# EAGLE design untitled (EAGLE 7.3.0)
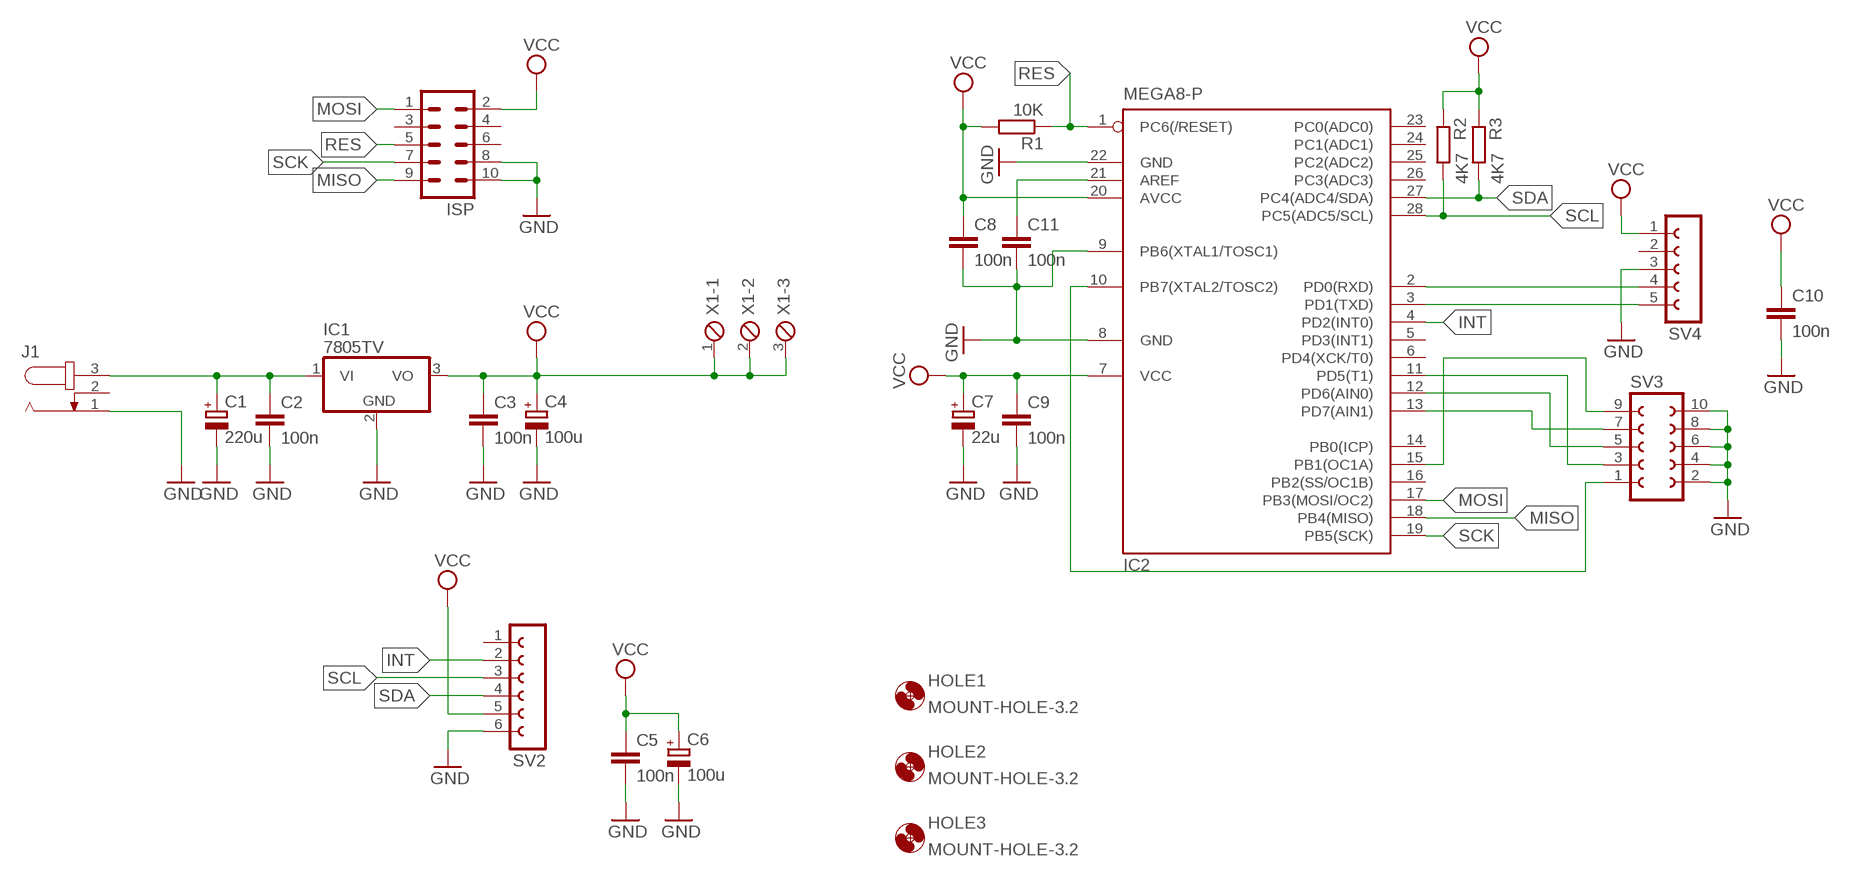
[diagram p0: schematic, sheet 1]

## Parts
C1  220u  CPOL-EUE3.5-8  [E3,5-8]
C2  100n  C-EU025-025X050  [C025-025X050]
C3  100n  C-EU025-025X050  [C025-025X050]
C4  100u  CPOL-EUE2.5-5  [E2,5-5]
C5  100n  C-EU025-025X050  [C025-025X050]
C6  100u  CPOL-EUE2.5-5  [E2,5-5]
C7  22u  CPOL-EUE2.5-5  [E2,5-5]
C8  100n  C-EU025-025X050  [C025-025X050]
C9  100n  C-EU025-030X050  [C025-030X050]
C10  100n  C-EU025-025X050  [C025-025X050]
C11  100n  C-EU025-025X050  [C025-025X050]
HOLE1  MOUNT-HOLE-3.2  [3,2]
HOLE2  MOUNT-HOLE-3.2  [3,2]
HOLE3  MOUNT-HOLE-3.2  [3,2]
IC1  7805TV  [TO220V]
IC2  MEGA8-P  [DIL28-3]
ISP  ML10  [ML10]
J1  JACK-PLUG1  [SPC4078]
R1  10K  R-EU_0204/7  [0204/7]
R2  4K7  R-EU_0204/7  [0204/7]
R3  4K7  R-EU_0204/7  [0204/7]
SV2  FE06-1  [FE06]
SV3  FE05-2  [FE05-2]
SV4  FE05-1  [FE05-1]
X1  MPT3  [3POL254]

## Nets
GND: C1.- C2.2 C3.2 C4.- C5.2 C6.- C7.- C8.2 C9.2 C10.2 C11.2 IC1.2(GND) IC2.8(GND) IC2.9(PB6(XTAL1/TOSC1)) IC2.22(GND) ISP.8 ISP.10 J1.1 SV2.6 SV3.2 SV3.4 SV3.6 SV3.8 SV3.10 SV4.3
INT: IC2.4(PD2(INT0)) SV2.2
MISO: IC2.18(PB4(MISO)) ISP.9
MOSI: IC2.17(PB3(MOSI/OC2)) ISP.1
N$1: C1.+ C2.1 IC1.1(VI) J1.3
N$2: C11.1 IC2.21(AREF)
N$4: IC2.2(PD0(RXD)) SV4.4
N$5: IC2.3(PD1(TXD)) SV4.5
N$6: IC2.10(PB7(XTAL2/TOSC2)) SV3.1
N$8: IC2.15(PB1(OC1A)) SV3.9
N$9: IC2.13(PD7(AIN1)) SV3.7
N$10: IC2.12(PD6(AIN0)) SV3.5
N$11: IC2.11(PD5(T1)) SV3.3
RES: IC2.1(PC6(/RESET)) ISP.5 R1.1
SCK: IC2.19(PB5(SCK)) ISP.7
SCL: IC2.28(PC5(ADC5/SCL)) R2.2 SV2.3
SDA: IC2.27(PC4(ADC4/SDA)) R3.2 SV2.4
VCC: C3.1 C4.+ C5.1 C6.+ C7.+ C8.1 C9.1 C10.1 IC1.3(VO) IC2.7(VCC) IC2.20(AVCC) ISP.2 R1.2 R2.1 R3.1 SV2.5 SV4.1 X1.1 X1.2 X1.3
Unconnected: IC2.5(PD3(INT1)) IC2.6(PD4(XCK/T0)) IC2.14(PB0(ICP)) IC2.16(PB2(SS/OC1B)) IC2.23(PC0(ADC0)) IC2.24(PC1(ADC1)) IC2.25(PC2(ADC2)) IC2.26(PC3(ADC3)) ISP.3 ISP.4 ISP.6 J1.2 SV2.1 SV4.2

## Library data of the parts
C1 C4 C6 C7 = rcl:CPOL-EU: POLARIZED CAPACITOR, European symbol
C2 C3 C5 C8-C11 = rcl:C-EU: CAPACITOR, European symbol
HOLE1-HOLE3 = holes:MOUNT-HOLE-: MOUNTING HOLE with drill center marker; BOM: EXCLUDE
IC1 = linear:78*: Positive VOLTAGE REGULATOR Source: http://cache.national.com/ds/LM/LM78L05.pdf http://www.fairchildsemi.com/ds/LM/LM7805.pdf
IC2 = atmel:MEGA8-P: MICROCONTROLLER 8 Kbytes FLASH, 1 kbytes SRAM, 512 bytes EEPROM, USART, 4-channel 10 bit ADC, 2-channel 8 bit ADC Pin compatible with Atmega48, ATMega88, ATMega168 Source: avr.lbr; OC_FARNELL: unknown; OC_NEWARK: unknown
ISP = con-harting-ml:ML10: HARTING; OC_FARNELL: unknown; OC_NEWARK: unknown
J1 = con-jack:JACK-PLUG: DC POWER JACK Power Jack, DC, Right Angle, Through Hole, Rated 5A at 16VDC, PC Terminals Distributor: Farnell (www.Farnell.de) Drawing: 84N1161.pdf / 84N1162.pdf Manufacturer: SPC Technology (www.spctechnology.com) Type: SPC4077 / SPC 4078; OC_FARNELL: unknown; OC_NEWARK: unknown
R1-R3 = rcl:R-EU_: RESISTOR, European symbol
SV2 = con-lsta:FE06-1: FEMALE HEADER; OC_FARNELL: unknown; OC_NEWARK: unknown
SV3 = con-lsta:FE05-2: FEMALE HEADER; OC_FARNELL: unknown; OC_NEWARK: unknown
SV4 = con-lsta:FE05-1: FEMALE HEADER; OC_FARNELL: unknown; OC_NEWARK: unknown
X1 = con-phoenix-254:MPT3: PHOENIX CONNECTOR; OC_FARNELL: unknown; OC_NEWARK: unknown

## Board
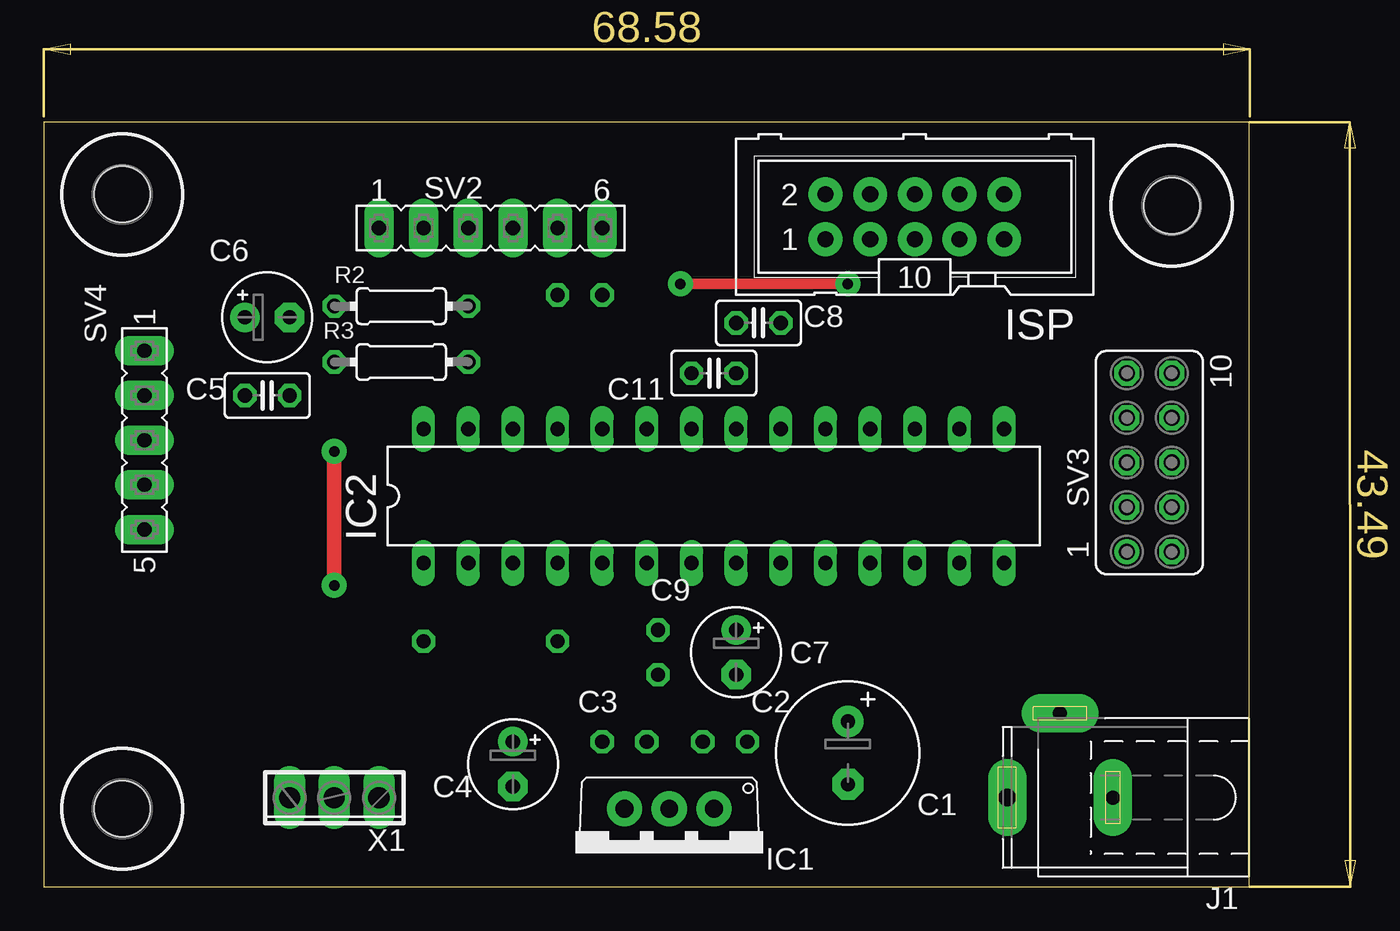
[diagram p1: board, top side]
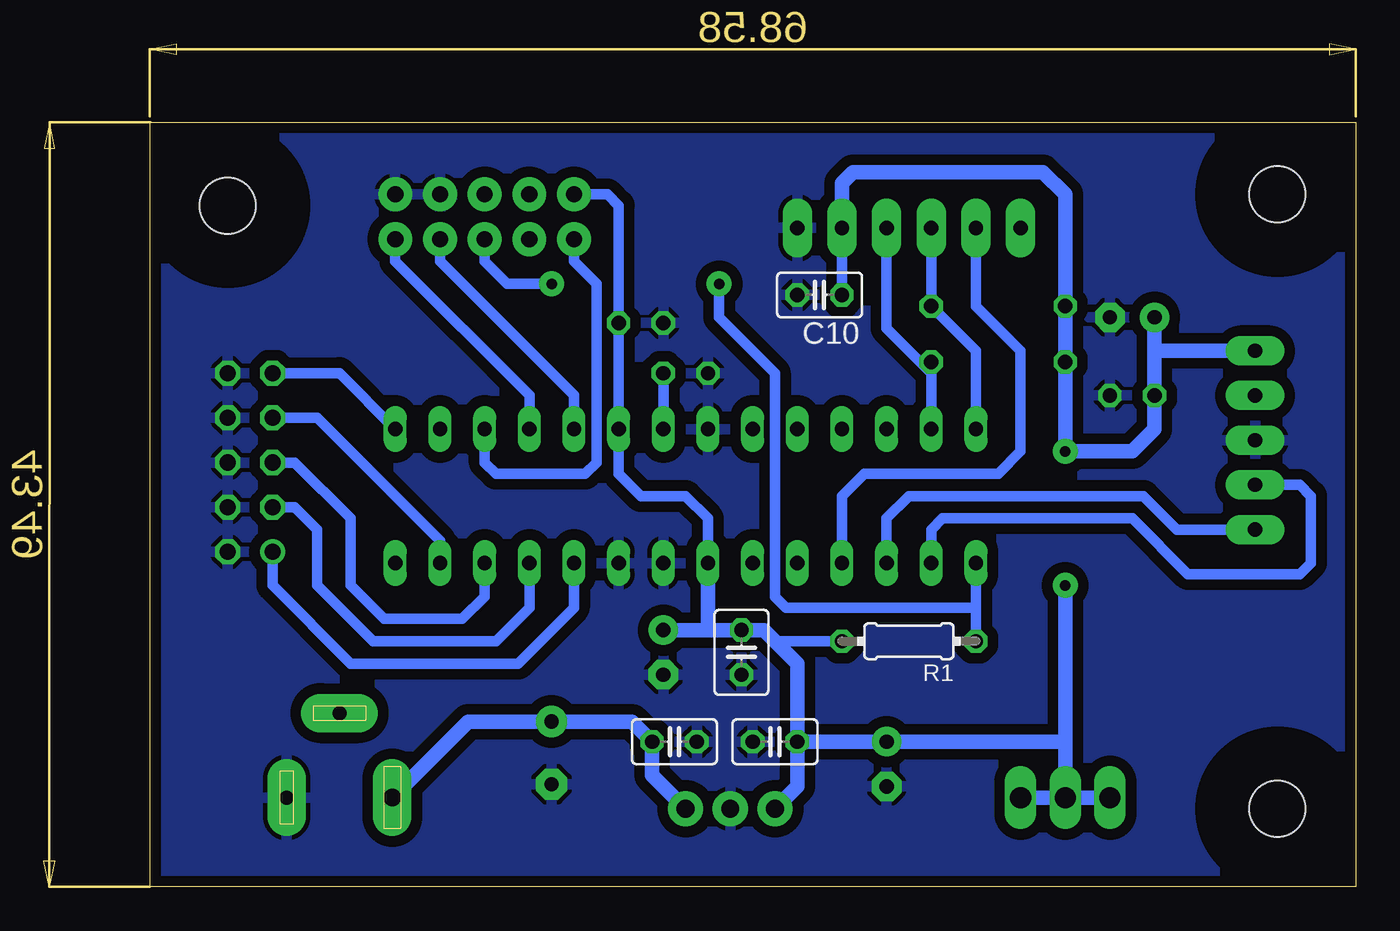
[diagram p2: board, bottom side, seen from below]

Size 68.56 x 43.48 mm. Coordinates in mm from the lower left corner, seen from the top.
Outline: 0,0 68.56,0 68.56,43.48 0,43.48 0,0
Copper layers (1*16): Top 0.035mm / dielectric 1.5mm / Bottom 0.035mm
Design rules "default *": minimum track width 10mil, minimum drill 24mil, track to track 8mil, track to pad 8mil, pad to pad 8mil, via to via 8mil, smd to smd 8mil, copper to edge 4mil, drill to drill 8mil, minimum pad ring 10mil, minimum via ring 8mil, stop-mask expansion 4mil, vias tented up to drill 0mil, thermal gap 10mil

### Footprints (pad centres in the part's own frame; a part is rotated, then mirrored left to right if it is on the bottom)
E3,5-8 = drill 0.813 pad 1.778: + -1.778,0 | drill 0.813 pad 1.778 octagon: - 1.778,0
C025-025X050 = drill 0.813 octagon: 1 -1.27,0; 2 1.27,0
E2,5-5 = drill 0.813 pad 1.676: + -1.27,0 | drill 0.813 pad 1.676 octagon: - 1.27,0
C025-030X050 = drill 0.813 octagon: 1 -1.27,0; 2 1.27,0
3,2 = hole 3.2: 0,0
TO220V = drill 1.016 pad 2: 1 -2.54,-2.54; 2 0,-2.54; 3 2.54,-2.54
DIL28-3 = drill 0.813 long: 1 -16.51,-3.81; 2 -13.97,-3.81; 3 -11.43,-3.81; 4 -8.89,-3.81; 5 -6.35,-3.81; 6 -3.81,-3.81; 7 -1.27,-3.81; 8 1.27,-3.81; 9 3.81,-3.81; 10 6.35,-3.81; 11 8.89,-3.81; 12 11.43,-3.81; 13 13.97,-3.81; 14 16.51,-3.81; 15 16.51,3.81; 16 13.97,3.81; 17 11.43,3.81; 18 8.89,3.81; 19 6.35,3.81; 20 3.81,3.81; 21 1.27,3.81; 22 -1.27,3.81; 23 -3.81,3.81; 24 -6.35,3.81; 25 -8.89,3.81; 26 -11.43,3.81; 27 -13.97,3.81; 28 -16.51,3.81
ML10 = drill 0.914 pad 1.93: 1 -5.08,-1.27; 2 -5.08,1.27; 3 -2.54,-1.27; 4 -2.54,1.27; 5 0,-1.27; 6 0,1.27; 7 2.54,-1.27; 8 2.54,1.27; 9 5.08,-1.27; 10 5.08,1.27
SPC4078 = drill 0.8 pad 2.184 long: 1 -3,0; 2 0,-4.8 | drill 1 pad 2.184 long: 3 3,0
0204/7 = drill 0.813 octagon: 1 -3.81,0; 2 3.81,0
FE06 = drill 0.813 pad 1.676 long: 1 -6.35,0; 2 -3.81,0; 3 -1.27,0; 4 1.27,0; 5 3.81,0; 6 6.35,0
FE05-2 = drill 0.914: 1 -5.08,1.27 | drill 0.914 octagon: 2 -5.08,-1.27; 3 -2.54,1.27; 4 -2.54,-1.27; 5 0,1.27; 6 0,-1.27; 7 2.54,1.27; 8 2.54,-1.27; 9 5.08,1.27; 10 5.08,-1.27
FE05-1 = drill 0.813 pad 1.676 long: 1 -5.08,0; 2 -2.54,0; 3 0,0; 4 2.54,0; 5 5.08,0
3POL254 = drill 1.2 long: 1 -2.54,0; 2 0,0; 3 2.54,0

### Placement (x,y rotation side)
C1  45.72,7.62 270 top
C2  38.73,8.26 0 bottom
C3  33.02,8.26 180 bottom
C4  26.67,6.99 270 top
C5  12.7,27.94 0 top
C6  12.7,32.38 0 top
C7  39.37,13.34 270 top
C8  40.64,32.07 180 top
C9  34.92,13.34 270 bottom
C10  30.48,33.66 180 bottom
C11  38.1,29.21 180 top
HOLE1  4.45,4.45 0 top
HOLE2  64.14,38.73 0 top
HOLE3  4.45,39.37 0 top
IC1  35.56,1.91 180 top
IC2  38.1,22.23 0 top
ISP  49.53,38.1 0 top
J1  57.78,5.08 180 top
R1  25.4,13.97 180 bottom
R2  20.32,33.02 0 top
R3  20.32,29.84 0 top
SV2  25.4,37.47 0 top
SV3  62.87,24.13 90 top
SV4  5.71,25.4 270 top
X1  16.51,5.08 180 top

### Tracks (layer width: path | path; a pad name or v marks a point on that pad's centre or on a via)
GND
  pour Bottom (isolate 0.61): 0,43.81 68.58,43.81 68.58,0 0,0
INT
  Bottom 0.61: SV2.2 21.59,33.02 19.05,30.48 19.05,24.77 20.32,23.5 27.94,23.5 29.21,22.23 IC2.4
MISO
  Bottom 0.61: ISP.9 54.61,35.56 46.99,27.94 IC2.18
MOSI
  Bottom 0.61: IC2.17 49.53,24.13 48.9,23.5 43.81,23.5 43.18,24.13 43.18,34.29 44.45,35.56 ISP.1
N$1
  Bottom 0.813: IC1.1 40.01,6.35 C2.1 41.15,9.4 C1.+ 50.47,9.4 J1.3
N$2
  Bottom 0.61: C11.1 IC2.21
N$4
  Bottom 0.61: SV4.4 3.17,22.86 2.54,22.23 2.54,18.41 3.17,17.78 9.53,17.78 12.7,20.95 23.5,20.95 24.13,20.32 IC2.2
N$5
  Bottom 0.61: IC2.3 26.67,20.95 25.4,22.23 12.06,22.23 10.16,20.32 SV4.5
N$6
  Bottom 0.61: IC2.10 44.45,15.88 47.62,12.7 57.15,12.7 61.59,17.14 SV3.1
N$8
  Bottom 0.61: SV3.9 57.78,29.21 IC2.15
N$9
  Bottom 0.61: SV3.7 59.05,26.67 52.07,19.68 IC2.13
N$10
  Bottom 0.61: SV3.5 60.33,24.13 57.15,20.95 57.15,17.14 55.24,15.24 50.8,15.24 49.53,16.51 IC2.12
N$11
  Bottom 0.61: SV3.3 60.33,21.59 59.05,20.32 59.05,17.14 55.88,13.97 48.9,13.97 46.99,15.88 IC2.11
RES  (via drill 0.6 pad 1.42)
  Top 0.61: v45.72,34.29 v36.2,34.29
  Bottom 0.61: IC2.1 21.59,15.88 | 21.59,15.88 R1.1 | v36.2,34.29 36.2,32.38 33.02,29.21 33.02,16.51 32.38,15.88 21.59,15.88 | ISP.5 49.53,35.56 48.26,34.29 v45.72,34.29
SCK
  Bottom 0.61: ISP.7 52.07,35.56 44.45,27.94 IC2.19
SCL
  Bottom 0.61: SV2.3 R2.2 21.59,30.48 IC2.28
SDA
  Bottom 0.61: SV2.4 26.67,31.75 24.45,29.53 | 24.45,29.53 24.13,29.21 IC2.27 | R3.2 24.45,29.53
VCC  (via drill 0.6 pad 1.42)
  Top 0.813: v16.51,17.14 v16.51,24.77
  Bottom 0.61: 29.21,36.56 SV2.5 C10.1 | ISP.2 42.55,39.37 41.91,38.73 C8.1 IC2.20 41.91,23.5 40.64,22.23 38.1,22.23 36.83,20.95 IC2.7 | R1.2 33.02,13.97
  Bottom 0.813: C3.1 31.75,5.71 IC1.3 | C3.1 C4.+ 16.51,8.26 | C7.+ 36.83,14.61 | 36.83,14.61 C9.1 33.66,14.61 33.02,13.97 31.75,12.7 C3.1 | IC2.7 36.83,14.61 | SV2.5 29.21,40.01 28.57,40.64 17.78,40.64 16.51,39.37 R2.1 R3.1 v16.51,24.77 12.7,24.77 11.43,26.04 C5.1 11.43,30.48 | C6.+ 11.43,30.48 | SV4.1 11.43,30.48 | 16.51,8.26 v16.51,17.14 | 16.51,8.26 X1.2 | X1.1 X1.2 | X1.3 X1.2